# EasyEDA schematic SCH_ESP32-Radio_2026-02-18.json
TITLE: Sheet_1; REV: 1.0; Date: 2024-02-20; Sheet: 1/1; Drawn By: Edzelf; Company: Your Company
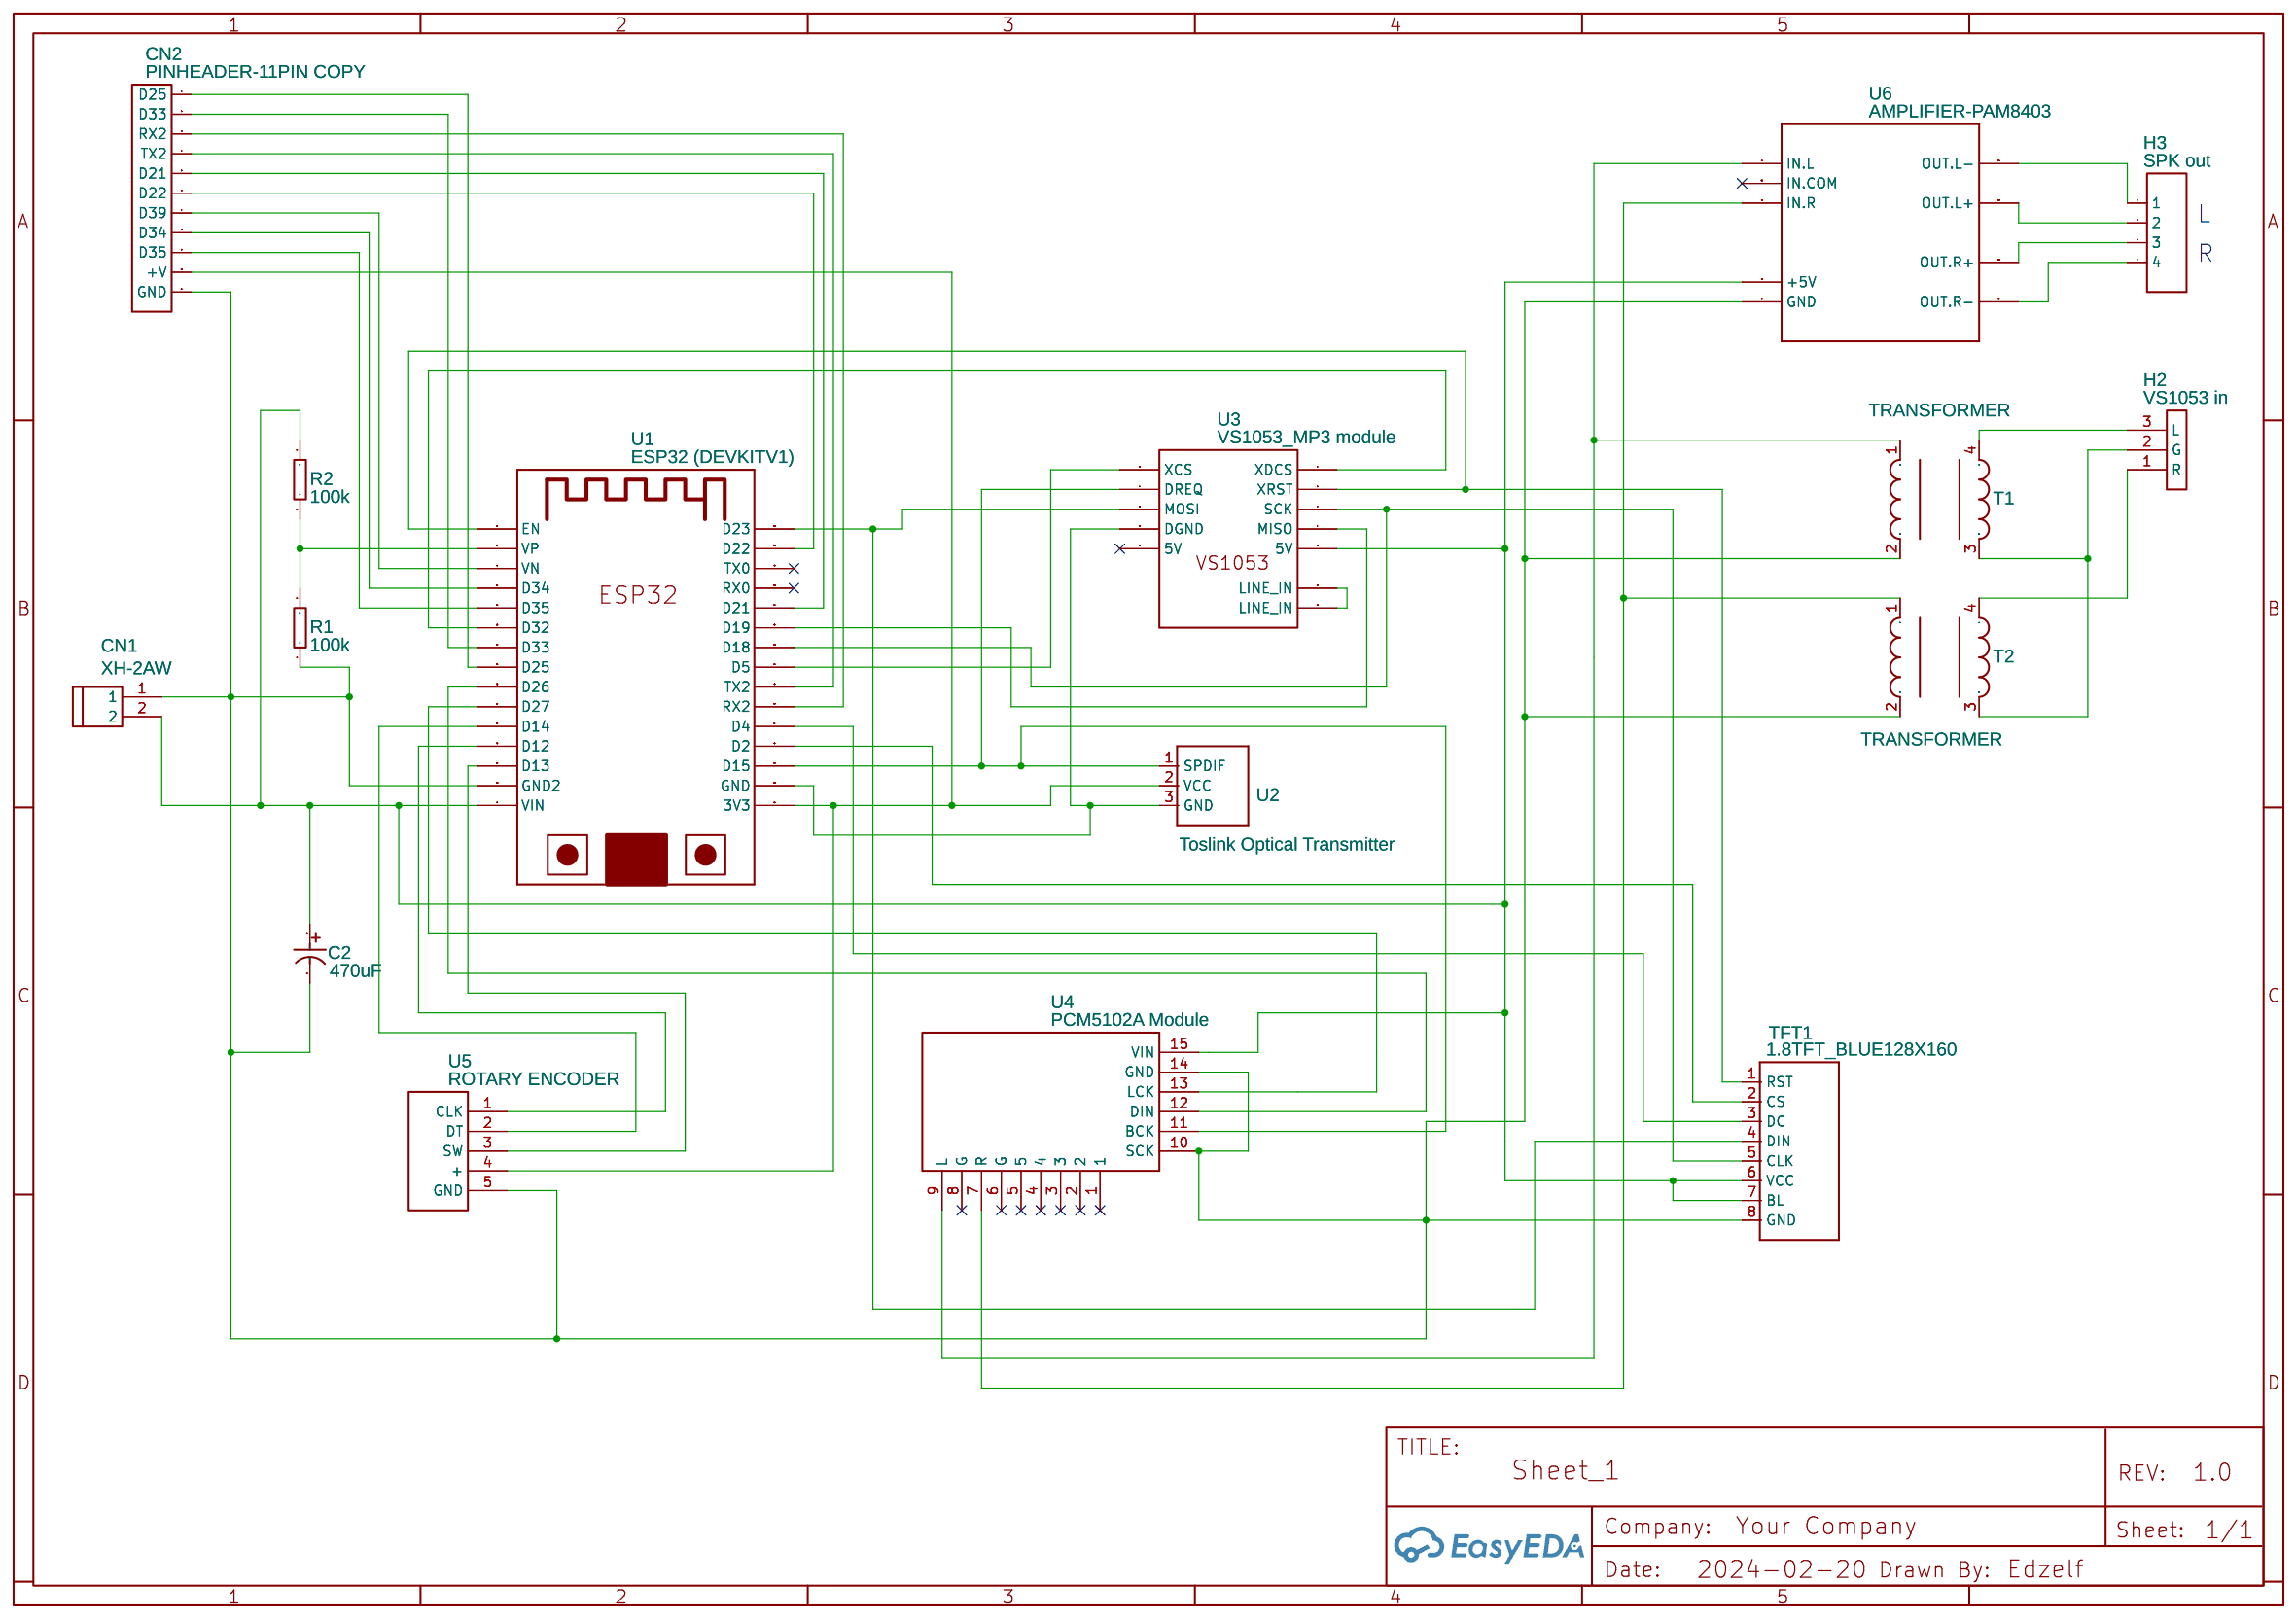
[diagram p0: schematic sheet]

## Parts
C2  470uF  [470UF CAPACITOR]
CN1  XH-2AW  [CONN-TH_2P-P2.50_XH-2AW]
CN2  PINHEADER-11PIN COPY  [PINHEADER-11PIN]
H2  VS1053 in  [PINS_HEADER1*3]
H3  SPK out  [6 PINS HEADER]
R1  100k  [RESISTOR 0.5W]
R2  100k  [RESISTOR 0.5W]
T1  TRANSFORMER  [TRANSFORMER]
T2  TRANSFORMER  [TRANSFORMER]
TFT1  1.8TFT_BLUE128X160  [1.8TFT_BLUE]
U1  ESP32 (DEVKITV1)  [ESP32-DEVKITV1_ESP32-DEVKITV1]
U2  Toslink Optical Transmitter  [TOTX178A]
U3  VS1053_MP3 module  [VS1053]
U4  PCM5102A Module  [PCM5102A]
U5  ROTARY ENCODER  [ROTARYENCODER]
U6  AMPLIFIER-PAM8403  [AMPLIFIER-PAM8403]

## Library data of the parts
C2 = 470UF 25V 8X14: Supplier: LCSC; Manufacturer: ValuePro; Manufacturer Part: 470uF 25V 8*14; Supplier Part: C44592
CN1 = XH-2AW: Supplier: LCSC; Manufacturer: BOOMELE(博穆精密); Supplier Part: C33132; JLCPCB Part Class: Extended Part
CN2 = PINHEADER-11PIN COPY: Contributor: Grzegorz Orlowski
H2 = Pins_header1*3: Contributor: Nattanan
H3 = HEADER 4 PINS: Supplier: LCSC; Manufacturer: BOOMELE; Manufacturer Part: Female headerHDR1X8-2.54; Supplier Part: C27438; Contributor: aldomezadev; subpart_no: 1; 3DModel: HDR-F-2.54_1x8
R1 R2 = Resistor 0.5W: Contributor: coronahelada
T1 T2 = TRANSFORMER: Contributor: SparkFun
TFT1 = 1.8TFT_BLUE128X160: Contributor: vincent dumouchel
U1 = ESP32-DEVKIT-V1-30PIN: Contributor: 2020896376
U2 = TOTX178A Toslink Optical Transmitter: Manufacturer: Toshiba; Contributor: softmachine
U3 = VS1053_MODULO_MP3: Contributor: horneczki
U4 = PCM5102A Module: Contributor: Jirawut Suttikampa
U5 = ROTARY ENCODER: Contributor: ugursefayalcindag
U6 = AMPLIFIER-PAM8403 COPY COPY: Stereo Class-D 3W Audio Amplifier based on PAM8403 chip

## Nets
Net-(C2-1): C2.1 CN1.2 R2.2 TFT1.6(VCC) TFT1.7(BL) U1.VIN U3.9(5V) U4.15(VIN) U6.+5V
Net-(C2-2): C2.2 CN1.1 CN2.11(GND) R1.1 T1.2 T2.2 TFT1.8(GND) U1.GND2 U4.10(SCK) U4.14(GND) U5.5(GND) U6.GND
Net-(CN2-1): CN2.1(D25) U1.D25
Net-(CN2-2): CN2.2(D33) U1.D33
Net-(CN2-3): CN2.3(RX2) U1.RX2
Net-(CN2-4): CN2.4(TX2) U1.TX2
Net-(CN2-5): CN2.5(D21) U1.D21
Net-(CN2-6): CN2.6(D22) U1.D22
Net-(CN2-7): CN2.7(D39) U1.VN
Net-(CN2-8): CN2.8(D34) U1.D34
Net-(CN2-9): CN2.9(D35) U1.D35
Net-(CN2-10): CN2.10(+V) U1.3V3 U2.2(VCC) U5.4(+)
Net-(H2-1): H2.1(R) T2.4
Net-(H2-2): H2.2(G) T1.3 T2.3
Net-(H2-3): H2.3(L) T1.4
Net-(H3-1): H3.1 U6.OUT.L-
Net-(H3-2): H3.2 U6.OUT.L+
Net-(H3-3): H3.3 U6.OUT.R+
Net-(H3-4): H3.4 U6.OUT.R-
Net-(R1-2): R1.2 R2.1 U1.VP
Net-(T1-1): T1.1 U4.9(L) U6.IN.L
Net-(T2-1): T2.1 U4.7(R) U6.IN.R
Net-(TFT1-1): TFT1.1(RST) U1.EN U3.3(XRST)
Net-(TFT1-2): TFT1.2(CS) U1.D2
Net-(TFT1-3): TFT1.3(DC) U1.D4
Net-(TFT1-4): TFT1.4(DIN) U1.D23 U3.6(MOSI)
Net-(TFT1-5): TFT1.5(CLK) U1.D18 U3.5(SCK)
Net-(U1-D5): U1.D5 U3.2(XCS)
Net-(U1-D12): U1.D12 U5.1(CLK)
Net-(U1-D13): U1.D13 U5.3(SW)
Net-(U1-D14): U1.D14 U5.2(DT)
Net-(U1-D15): U1.D15 U2.1(SPDIF) U3.4(DREQ) U4.11(BCK)
Net-(U1-D19): U1.D19 U3.7(MISO)
Net-(U1-D26): U1.D26 U4.12(DIN)
Net-(U1-D27): U1.D27 U4.13(LCK)
Net-(U1-D32): U1.D32 U3.1(XDCS)
Net-(U1-GND): U1.GND U2.3(GND) U3.8(DGND)
Net-(U3-11): U3.11(LINE IN) U3.12(LINE IN)

Not connected (* = marked no-connect by the designer): U1 RX0* TX0*; U3 10(5V)*; U4 1* 2* 3* 4* 5* 6(G)* 8(G)*; U6 IN.COM*

## Notes on the sheet
- L
- R
